# Altium schematic sheet powersupply.SchDoc: Power supply
size A4; Organization: GPA Robotics; DocumentNumber: 4; Revision: REV 0; SheetNumber: 4; SheetTotal: 4
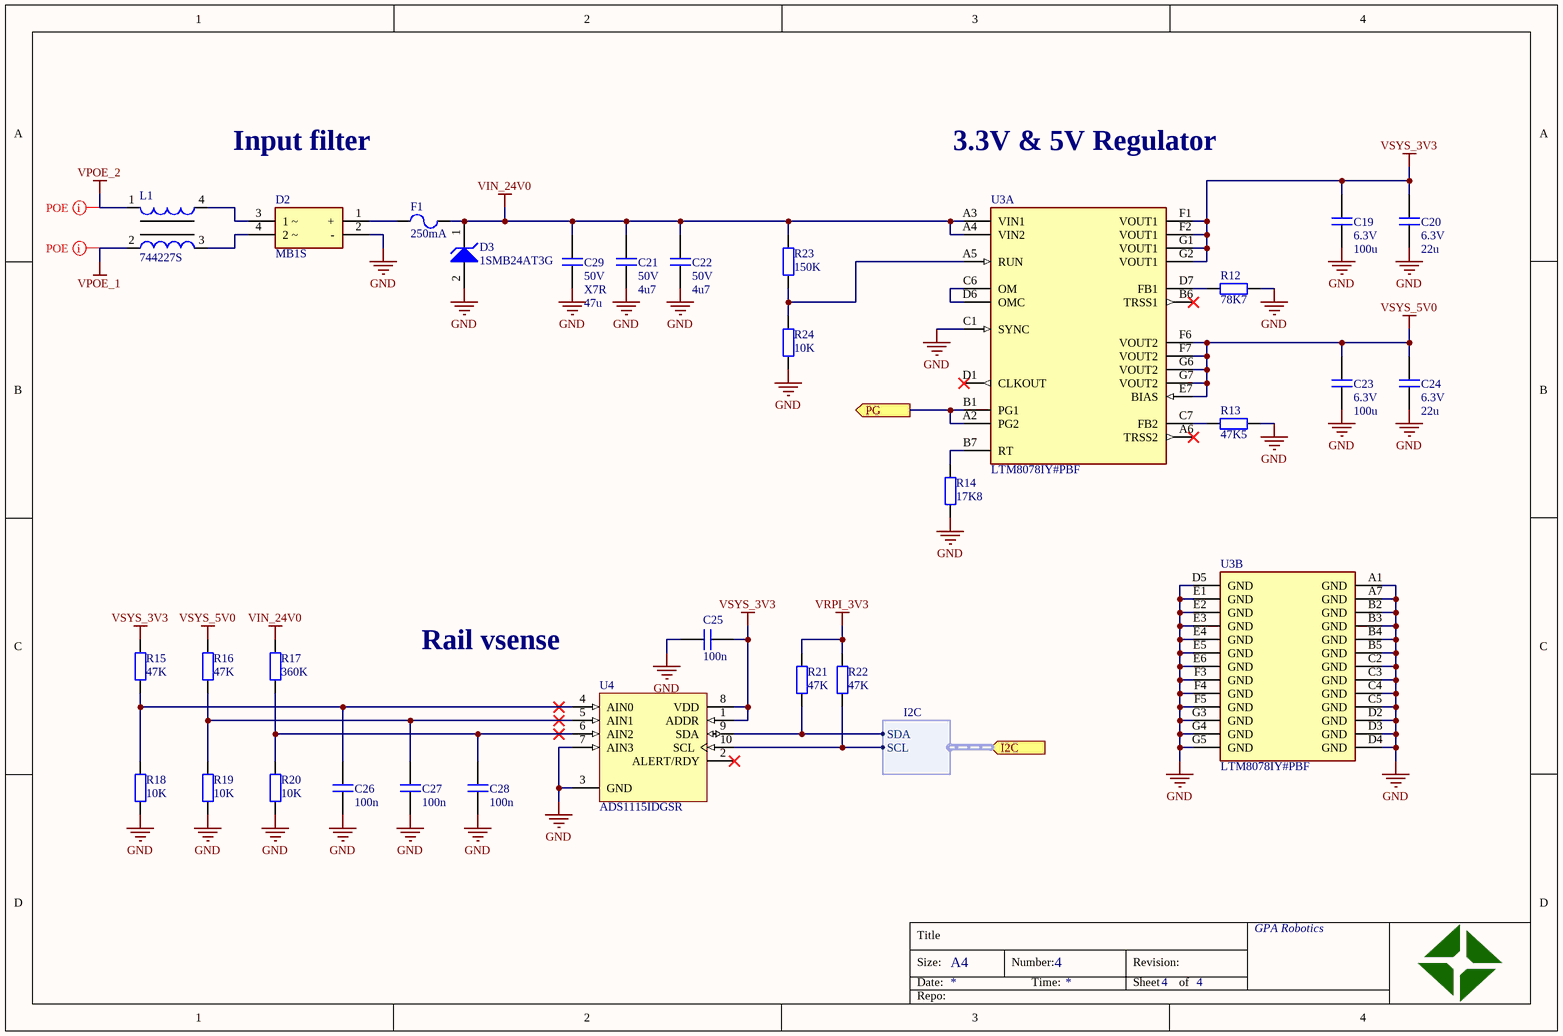
[diagram p0: powersupply.SchDoc]

## Parts
C19  value 100u  voltage: 6.3V  [CAPC2012X11N]  (hidden comment: cap)
C20  value 22u  voltage: 6.3V  [CAPC2012X11N]  (hidden comment: cap)
C21  value 4u7  voltage: 50V  [CAPC2012X11N]  (hidden comment: cap)
C22  value 4u7  voltage: 50V  [CAPC2012X11N]  (hidden comment: cap)
C23  value 100u  voltage: 6.3V  [CAPC2012X11N]  (hidden comment: cap)
C24  value 22u  voltage: 6.3V  [CAPC2012X11N]  (hidden comment: cap)
C25  value 100n  [CAPC1005X06N]  (hidden comment: cap)
C26  value 100n  [CAPC1005X06N]  (hidden comment: cap)
C27  value 100n  [CAPC1005X06N]  (hidden comment: cap)
C28  value 100n  [CAPC1005X06N]  (hidden comment: cap)
C29  value 47u  voltage: 50V  type: X7R  [CAPC3225X14N]  (hidden comment: cap)
D2  MB1S  [FP-751EP-MFG]
D3  1SMB24AT3G  [ONSC-SMB-2-403A-03_H_V]
F1  value 250mA  [RESC1608X06N]  (hidden comment: fuse)
L1  744227S  [WE-SL2]
R12  value 78K7  [RESC1005X04N]  (hidden comment: res)
R13  value 47K5  [RESC1005X04N]  (hidden comment: res)
R14  value 17K8  [RESC1005X04N]  (hidden comment: res)
R15  value 47K  [RESC1005X04N]  (hidden comment: res)
R16  value 47K  [RESC1005X04N]  (hidden comment: res)
R17  value 360K  [RESC1005X04N]  (hidden comment: res)
R18  value 10K  [RESC1005X04N]  (hidden comment: res)
R19  value 10K  [RESC1005X04N]  (hidden comment: res)
R20  value 10K  [RESC1005X04N]  (hidden comment: res)
R21  value 47K  [RESC1005X04N]  (hidden comment: res)
R22  value 47K  [RESC1005X04N]  (hidden comment: res)
R23  value 150K  [RESC1005X04N]  (hidden comment: res)
R24  value 10K  [RESC1005X04N]  (hidden comment: res)
U3  LTM8078IY#PBF  [FP-BGA-49-05-08-1518-MFG]  (parts A,B of 2)
U4  ADS1115IDGSR  [TI-DGS10_N]

## Ports
I2C (in, harness I2C), PG (out)

## Harnesses
I2C: SDA, SCL

## Nets
GND: C19.1 C20.1 C21.1 C22.1 C23.1 C24.1 C25.1 C26.1 C27.1 C28.1 C29.1 D2.2(-) D3.2(A) R12.2 R13.2 R14.1 R18.1 R19.1 R20.1 R24.1 U3.A1(GND) U3.A7(GND) U3.B2(GND) U3.B3(GND) U3.B4(GND) U3.B5(GND) U3.C1(SYNC) U3.C2(GND) U3.C3(GND) U3.C4(GND) U3.C5(GND) U3.D2(GND) U3.D3(GND) U3.D4(GND) U3.D5(GND) U3.E1(GND) U3.E2(GND) U3.E3(GND) U3.E4(GND) U3.E5(GND) U3.E6(GND) U3.F3(GND) U3.F4(GND) U3.F5(GND) U3.G3(GND) U3.G4(GND) U3.G5(GND) U4.3(GND) U4.7(AIN3)
VIN_24V0: C21.2 C22.2 C29.2 D3.1(K) F1.2 R17.2 R23.2 U3.A3(VIN1) U3.A4(VIN2)
VPOE_1: L1.2
VPOE_2: L1.1
VRPI_3V3: R21.2 R22.2
VSYS_3V3: C19.2 C20.2 C25.2 R15.2 U3.F1(VOUT1) U3.F2(VOUT1) U3.G1(VOUT1) U3.G2(VOUT1) U4.1(ADDR) U4.8(VDD)
VSYS_5V0: C23.2 C24.2 R16.2 U3.E7(BIAS) U3.F6(VOUT2) U3.F7(VOUT2) U3.G6(VOUT2) U3.G7(VOUT2)
PG: U3.A2(PG2) U3.B1(PG1) ; port PG
NetC26_2: C26.2 R15.1 R18.2 U4.4(AIN0)
NetC27_2: C27.2 R16.1 R19.2 U4.5(AIN1)
NetC28_2: C28.2 R17.1 R20.2 U4.6(AIN2)
NetD2_1: D2.1(+) F1.1
NetD2_3: D2.3(1_~) L1.4
NetD2_4: D2.4(2_~) L1.3
NetR12_1: R12.1 U3.D7(FB1)
NetR13_1: R13.1 U3.C7(FB2)
NetR14_2: R14.2 U3.B7(RT)
NetR21_1: R21.1 U4.9(SDA) ; port I2C.SDA
NetR22_1: R22.1 U4.10(SCL) ; port I2C.SCL
NetR23_1: R23.1 R24.2 U3.A5(RUN)
NetU3_C6: U3.C6(OM) U3.D6(OMC)

Not connected (* = marked no-connect by the designer): U3 A6(TRSS2)* B6(TRSS1)* D1(CLKOUT)*; U4 2(ALERT/RDY)*

## Layout directives
net class POE: VPOE_1, VPOE_2

## Notes on the sheet
- Input filter
- 3.3V & 5V Regulator
- Rail vsense
- Title
- Size:
- Date:
- A4
- Number:
- Time:
- Revision:
- Sheet
- of
- Repo:

## Library data of the parts
C19-C29 = cap: Capacitor; #digikey: *; #mouser: *
  C19-C24: type: *
  C25-C28: voltage: *; type: *
D2 = CMP-07163-000028-1: BRIDGE RECT 1P 100V 500MA 4SOIC; Manufacturer: ON Semiconductor; Forward Current: 0.5A; Value: 13pF; Max Surge Forward Current: 35A; Max Junction Temp: +150°C; Peak Reverse Current: 5uA; Standoff Height: 0.05mm; Temperature: -55°C to +150°C; Ipc Land Pattern Name: SOIC254P670X265-4; Digikey Description: BRIDGE RECT 1P 100V 500MA 4SOIC; Device Class L3: Rectifier Diodes; Max Repetitive Reverse Voltage: 100V; Device Class L2: Diodes; Automotive: No; RoHS: TRUE; ComponentLink2Description: Datasheet; Manufacturer Part Number: MB1S; Mouser Description: Diode Rectifier Bridge Single 100V 0.5A 4-Pin SOIC N T/R; Temperature Range Low: -55°C; Category: Diode; ComponentLink2URL: https://www.onsemi.com/pub/Collateral/MB8S-D.PDF; Reverse Voltage: 100V; Package: 751EP; Temperature Range High: +150°C; Octopart: https://octopart.com/mb1s-on+semiconductor-84329760; Footprint Url: https://www.onsemi.com/pub/Collateral/751EP.PDF; Capacitance: 13pF; Height: 2.9mm; Lead Free: Yes; Device Class L1: Discrete Semiconductors
D3 = CMP-1061-00363-1: 600 W Peak Power Zener Transient Voltage Suppressor, Unidirectional, 2-Pin SMB, Pb-Free, Tape and Reel; Manufacturer: On Semiconductor; IR Max (uA): 5; PPK Max (W): 600; V(BR) Typ (V): 28.1; Packing: Tape and Reel; ComponentLink2URL: http://www.onsemi.com/pub_link/Collateral/1SMB5.0AT3-D.PDF; RoHS: Pb-Free; ComponentLink1URL: http://www.onsemi.com/; PackageVersion: Rev. H, 05/2011; ComponentLink1Description: Manufacturer URL; ComponentLink3Description: Package Specification; PartNumber: 1SMB24AT3G; PackageDescription: 2-Pin Small Molded Package, J-Bend Lead, Body 4.33 x 3.625 mm; Mounting Technology: Surface Mount; ComponentLink2Description: Datasheet; PackageReference: SMB-2-403A-03_H; ComponentLink3URL: http://www.onsemi.com/pub_link/Collateral/1SMB5913BT3-D.PDF; Direction: Unidirectional; DatasheetVersion: Rev. 13
F1 = fuse: Resistor; voltage: *; #digikey: *; #mouser: *
L1 = CMP-0222-00062-1: SMD Common Mode Line Filter WE-SL2, L = 51.0 µH; Inductance: 51.0 ÂµH; ComponentLink2Description: Datasheet; PackageDescription: SMD Inductor, 4-Leads, Body 6.3 x 9.5 mm; DatasheetVersion: ver 7, Oct-2004; ComponentLink2URL: http://www.we-online.de/katalog/media/pdf/744227S.pdf; PackageReference: WE-SL2; ComponentLink1Description: Manufacturer Link; ComponentLink1URL: http://www.we-online.com; PackageVersion: 2010
R12-R24 = res: Resistor; power: *; voltage: *; #digikey: *; #mouser: *
U3 = CMP-09139-000029-1: DUAL 40VIN, 3A SILENT SWITCR UMO
U4 = CMP-0003-00385-2: 16-Bit ADC with Integrated Multiplexer, PGA, Comparator, Oscillator, and Reference, -40 to 125 degC, 10-pin SOP (DGS10), Green (RoHS & no Sb/Br); Manufacturer: Texas Instruments; Digital Supply(Min)(V): 2; # Input Channels: 4; Resolution(Bits): 16; SubFamily: Precision ADC (<=10MSPS); Sample Rate (max)(SPS): 860; Analog Voltage AV/DD(Max)(V): 5.5; INL(Max)(+/-LSB): 1; Interface: Serial I2C; Architecture: Delta-Sigma; PackageVersion: 4073272/C, 02/2004; Mounting Technology: Surface Mount; ComponentLink1URL: http://www.ti.com/; Eco-Plan: Green (RoHS & no Sb/Br); Analog Voltage AV/DD(Min)(V): 2; ComponentLink3URL: http://www.ti.com/lit/ml/mpds035b/mpds035b.pdf; PartNumber: ADS1115IDGSR; ComponentLink3Description: Package Specification; DatasheetVersion: SBAS444B; ComponentLink1Description: Manufacturer URL; Code_JEDEC: MO-153; Digital Supply(Max)(V): 5.5; ComponentLink2Description: Datasheet; ComponentLink2URL: http://www.ti.com/general/docs/lit/getliterature.tsp?genericPartNumber=ADS1115&fileType=pdf; PackageDescription: 10-Pin Plastic Small Outline, Body 3 x 3 mm, Pitch 0.5 mm; PackageReference: DGS10